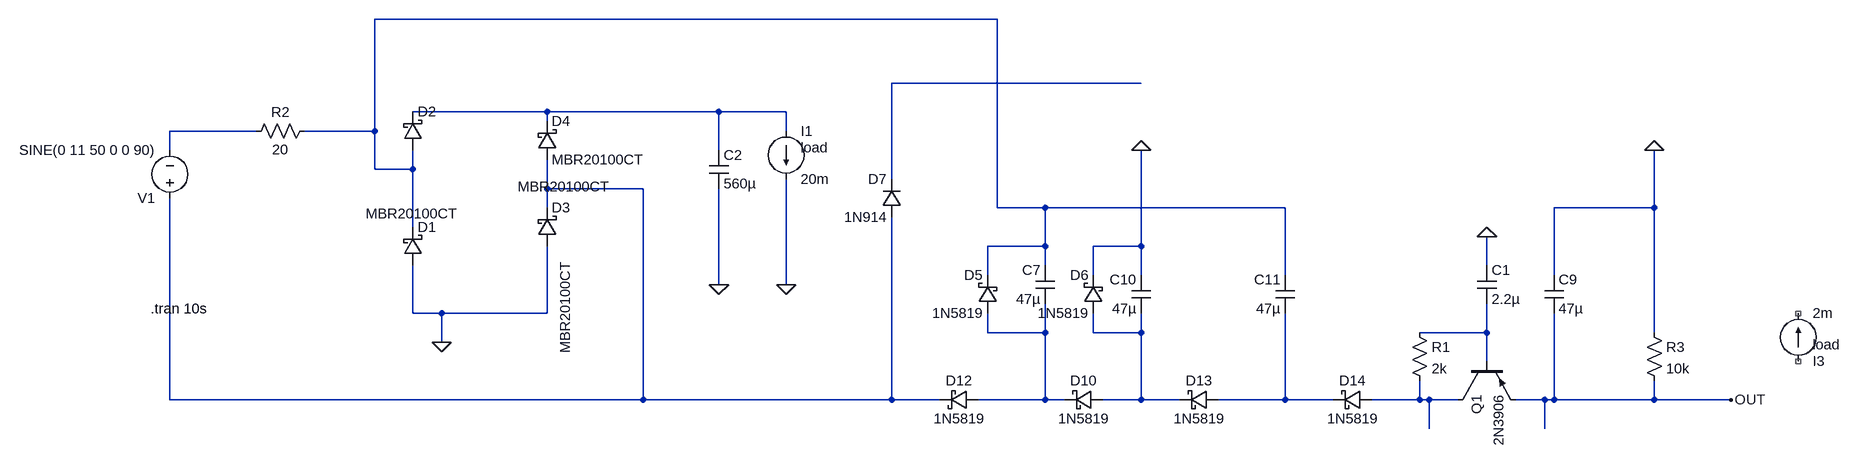
[diagram p0: schematic aux_neg_rail_charge_pump.asc]
aux_neg_rail_charge_pump.asc, the LTspice schematic file:
Version 4
SHEET 1 3604 680
WIRE 608 -704 -480 -704
WIRE 848 -576 432 -576
WIRE -144 -528 -416 -528
WIRE 144 -528 -144 -528
WIRE 256 -528 144 -528
WIRE -144 -512 -144 -528
WIRE -832 -496 -976 -496
WIRE -480 -496 -480 -704
WIRE -480 -496 -752 -496
WIRE 256 -496 256 -528
WIRE -976 -464 -976 -496
WIRE 144 -464 144 -528
WIRE -480 -432 -480 -496
WIRE -416 -432 -416 -464
WIRE -416 -432 -480 -432
WIRE 432 -416 432 -576
WIRE -144 -400 -144 -448
WIRE 16 -400 -144 -400
WIRE -144 -368 -144 -400
WIRE 608 -368 608 -704
WIRE 688 -368 608 -368
WIRE 1088 -368 688 -368
WIRE 1808 -368 1808 -464
WIRE 1808 -368 1536 -368
WIRE -416 -336 -416 -432
WIRE 688 -304 688 -368
WIRE 688 -304 592 -304
WIRE 848 -304 848 -464
WIRE 848 -304 768 -304
WIRE 688 -272 688 -304
WIRE 1424 -272 1424 -320
WIRE 592 -256 592 -304
WIRE 768 -256 768 -304
WIRE 848 -256 848 -304
WIRE 1088 -256 1088 -368
WIRE 1536 -256 1536 -368
WIRE 144 -240 144 -400
WIRE 256 -240 256 -416
WIRE -416 -192 -416 -272
WIRE -368 -192 -416 -192
WIRE -144 -192 -144 -304
WIRE -144 -192 -368 -192
WIRE 592 -160 592 -192
WIRE 688 -160 688 -208
WIRE 688 -160 592 -160
WIRE 768 -160 768 -192
WIRE 848 -160 848 -192
WIRE 848 -160 768 -160
WIRE 1424 -160 1424 -208
WIRE 1424 -160 1312 -160
WIRE 1808 -160 1808 -368
WIRE -368 -144 -368 -192
WIRE 1424 -112 1424 -160
WIRE -976 -48 -976 -384
WIRE 16 -48 16 -400
WIRE 16 -48 -976 -48
WIRE 432 -48 432 -352
WIRE 432 -48 16 -48
WIRE 512 -48 432 -48
WIRE 688 -48 688 -160
WIRE 688 -48 576 -48
WIRE 720 -48 688 -48
WIRE 848 -48 848 -160
WIRE 848 -48 784 -48
WIRE 912 -48 848 -48
WIRE 1088 -48 1088 -192
WIRE 1088 -48 976 -48
WIRE 1168 -48 1088 -48
WIRE 1312 -48 1312 -80
WIRE 1312 -48 1232 -48
WIRE 1328 -48 1312 -48
WIRE 1376 -48 1328 -48
WIRE 1520 -48 1472 -48
WIRE 1536 -48 1536 -192
WIRE 1536 -48 1520 -48
WIRE 1808 -48 1808 -80
WIRE 1808 -48 1536 -48
WIRE 1936 -48 1808 -48
WIRE 1328 0 1328 -48
WIRE 1520 0 1520 -48
FLAG -368 -144 0
FLAG 144 -240 0
FLAG 256 -240 0
FLAG 1808 -464 0
FLAG 1936 -48 OUT
FLAG 1424 -320 0
FLAG 848 -464 0
SYMBOL schottky -432 -272 M180
WINDOW 0 24 64 Left 2
WINDOW 3 -63 86 Left 2
SYMATTR InstName D1
SYMATTR Value MBR20100CT
SYMATTR Description Diode
SYMATTR Type diode
SYMBOL schottky -432 -464 M180
WINDOW 0 24 64 Left 2
WINDOW 3 239 -61 Left 2
SYMATTR InstName D2
SYMATTR Value MBR20100CT
SYMATTR Description Diode
SYMATTR Type diode
SYMBOL schottky -160 -304 M180
WINDOW 0 24 64 Left 2
WINDOW 3 47 -26 VLeft 2
SYMATTR InstName D3
SYMATTR Value MBR20100CT
SYMATTR Description Diode
SYMATTR Type diode
SYMBOL schottky -160 -448 M180
WINDOW 0 24 64 Left 2
WINDOW 3 24 0 Left 2
SYMATTR InstName D4
SYMATTR Value MBR20100CT
SYMATTR Description Diode
SYMATTR Type diode
SYMBOL res -736 -512 R90
WINDOW 0 0 56 VBottom 2
WINDOW 3 32 56 VTop 2
SYMATTR InstName R2
SYMATTR Value 20
SYMBOL voltage -976 -368 R180
WINDOW 123 0 0 Left 2
WINDOW 39 0 0 Left 2
SYMATTR InstName V1
SYMATTR Value SINE(0 11 50 0 0 90)
SYMBOL current 256 -496 R0
WINDOW 123 0 0 Left 2
WINDOW 39 24 28 Left 2
SYMATTR SpiceLine load
SYMATTR InstName I1
SYMATTR Value 20m
SYMBOL cap 128 -464 R0
SYMATTR InstName C2
SYMATTR Value 560µ
SYMBOL cap 704 -208 R180
WINDOW 0 24 56 Left 2
WINDOW 3 24 8 Left 2
SYMATTR InstName C7
SYMATTR Value 47µ
SYMATTR SpiceLine Rser=150m
SYMBOL schottky 784 -32 M270
WINDOW 0 32 32 VTop 2
WINDOW 3 0 32 VBottom 2
SYMATTR InstName D10
SYMATTR Value 1N5819
SYMATTR Description Diode
SYMATTR Type diode
SYMBOL cap 1520 -192 M180
WINDOW 0 24 56 Left 2
WINDOW 3 24 8 Left 2
SYMATTR InstName C9
SYMATTR Value 47µ
SYMATTR SpiceLine Rser=150m
SYMBOL current 2048 -112 M180
WINDOW 123 0 0 Left 0
WINDOW 39 24 28 Left 2
SYMATTR SpiceLine load
SYMATTR InstName I3
SYMATTR Value 2m
SYMBOL schottky 576 -64 R90
WINDOW 0 0 32 VBottom 2
WINDOW 3 32 32 VTop 2
SYMATTR InstName D12
SYMATTR Value 1N5819
SYMATTR Description Diode
SYMATTR Type diode
SYMBOL schottky 976 -32 M270
WINDOW 0 32 32 VTop 2
WINDOW 3 0 32 VBottom 2
SYMATTR InstName D13
SYMATTR Value 1N5819
SYMATTR Description Diode
SYMATTR Type diode
SYMBOL schottky 1232 -32 M270
WINDOW 0 32 32 VTop 2
WINDOW 3 0 32 VBottom 2
SYMATTR InstName D14
SYMATTR Value 1N5819
SYMATTR Description Diode
SYMATTR Type diode
SYMBOL cap 864 -192 R180
WINDOW 0 24 56 Left 2
WINDOW 3 24 8 Left 2
SYMATTR InstName C10
SYMATTR Value 47µ
SYMATTR SpiceLine Rser=150m
SYMBOL cap 1104 -192 R180
WINDOW 0 24 56 Left 2
WINDOW 3 24 8 Left 2
SYMATTR InstName C11
SYMATTR Value 47µ
SYMATTR SpiceLine Rser=150m
SYMBOL schottky 608 -192 R180
WINDOW 0 24 64 Left 2
WINDOW 3 24 0 Left 2
SYMATTR InstName D5
SYMATTR Value 1N5819
SYMATTR Description Diode
SYMATTR Type diode
SYMBOL schottky 784 -192 R180
WINDOW 0 24 64 Left 2
WINDOW 3 24 0 Left 2
SYMATTR InstName D6
SYMATTR Value 1N5819
SYMATTR Description Diode
SYMATTR Type diode
SYMBOL pnp 1376 -112 M90
SYMATTR InstName Q1
SYMATTR Value 2N3906
SYMBOL cap 1408 -272 R0
SYMATTR InstName C1
SYMATTR Value 2.2µ
SYMBOL res 1296 -176 R0
SYMATTR InstName R1
SYMATTR Value 2k
SYMBOL diode 448 -352 R180
WINDOW 0 24 64 Left 2
WINDOW 3 24 0 Left 2
SYMATTR InstName D7
SYMATTR Value 1N914
SYMBOL res 1792 -176 R0
SYMATTR InstName R3
SYMATTR Value 10k
TEXT -1008 -200 Left 2 !.tran 10s

The netlist it stands for:
* aux_neg_rail_charge_pump.asc
D1 0 N001 MBR20100CT
D2 N001 N003 MBR20100CT
D3 0 N005 MBR20100CT
D4 N005 N003 MBR20100CT
R2 N001 N004 20
V1 N005 N004 SINE(0 11 50 0 0 90)
I1 N003 0 20m load
C2 N003 0 560µ
C7 N006 N001 47µ Rser=150m
D10 N007 N006 1N5819
C9 OUT 0 47µ Rser=150m
I3 NC_01 NC_02 2m load
D12 N006 N005 1N5819
D13 N009 N007 1N5819
D14 N010 N009 1N5819
C10 N007 0 47µ Rser=150m
C11 N009 N001 47µ Rser=150m
D5 N006 N001 1N5819
D6 N007 0 1N5819
Q1 N010 N008 OUT 0 2N3906
C1 0 N008 2.2µ
R1 N008 N010 2k
D7 N005 N002 1N914
R3 0 OUT 10k
.model D D
.lib standard.dio
.model NPN NPN
.model PNP PNP
.lib standard.bjt
.tran 10s
.backanno
.end